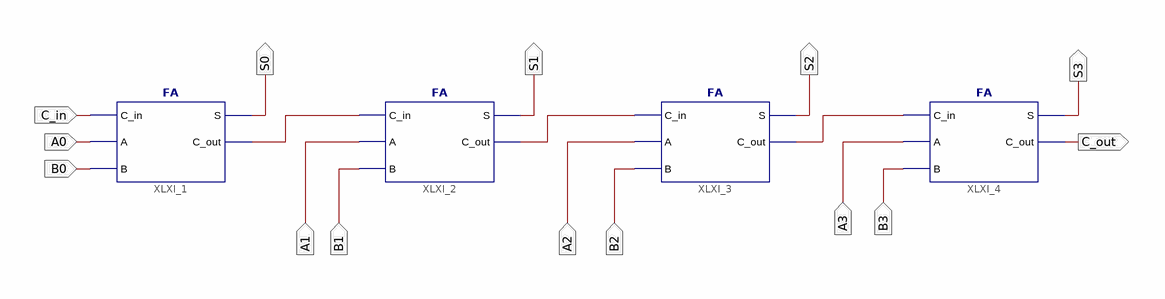
[diagram p0: schematic sheet 1]
// Xilinx ISE schematic FOUR_RCA.sch (spartan3e) as structural Verilog: 4 symbols, 14 ports
module FOUR_RCA (
  input  A0,
  input  B0,
  input  C_in,
  input  A1,
  input  B1,
  input  A2,
  input  B2,
  input  A3,
  input  B3,
  output S0,
  output S1,
  output S2,
  output S3,
  output C_out
);

  wire XLXN_4, XLXN_19, XLXN_22;

  FA XLXI_1 (.A(A0), .B(B0), .C_in(C_in), .C_out(XLXN_4), .S(S0));
  FA XLXI_2 (.A(A1), .B(B1), .C_in(XLXN_4), .C_out(XLXN_19), .S(S1));
  FA XLXI_3 (.A(A2), .B(B2), .C_in(XLXN_19), .C_out(XLXN_22), .S(S2));
  FA XLXI_4 (.A(A3), .B(B3), .C_in(XLXN_22), .C_out(C_out), .S(S3));
endmodule
